# EAGLE design IOTBee-Carrier v0.1 (EAGLE 6.6.0)
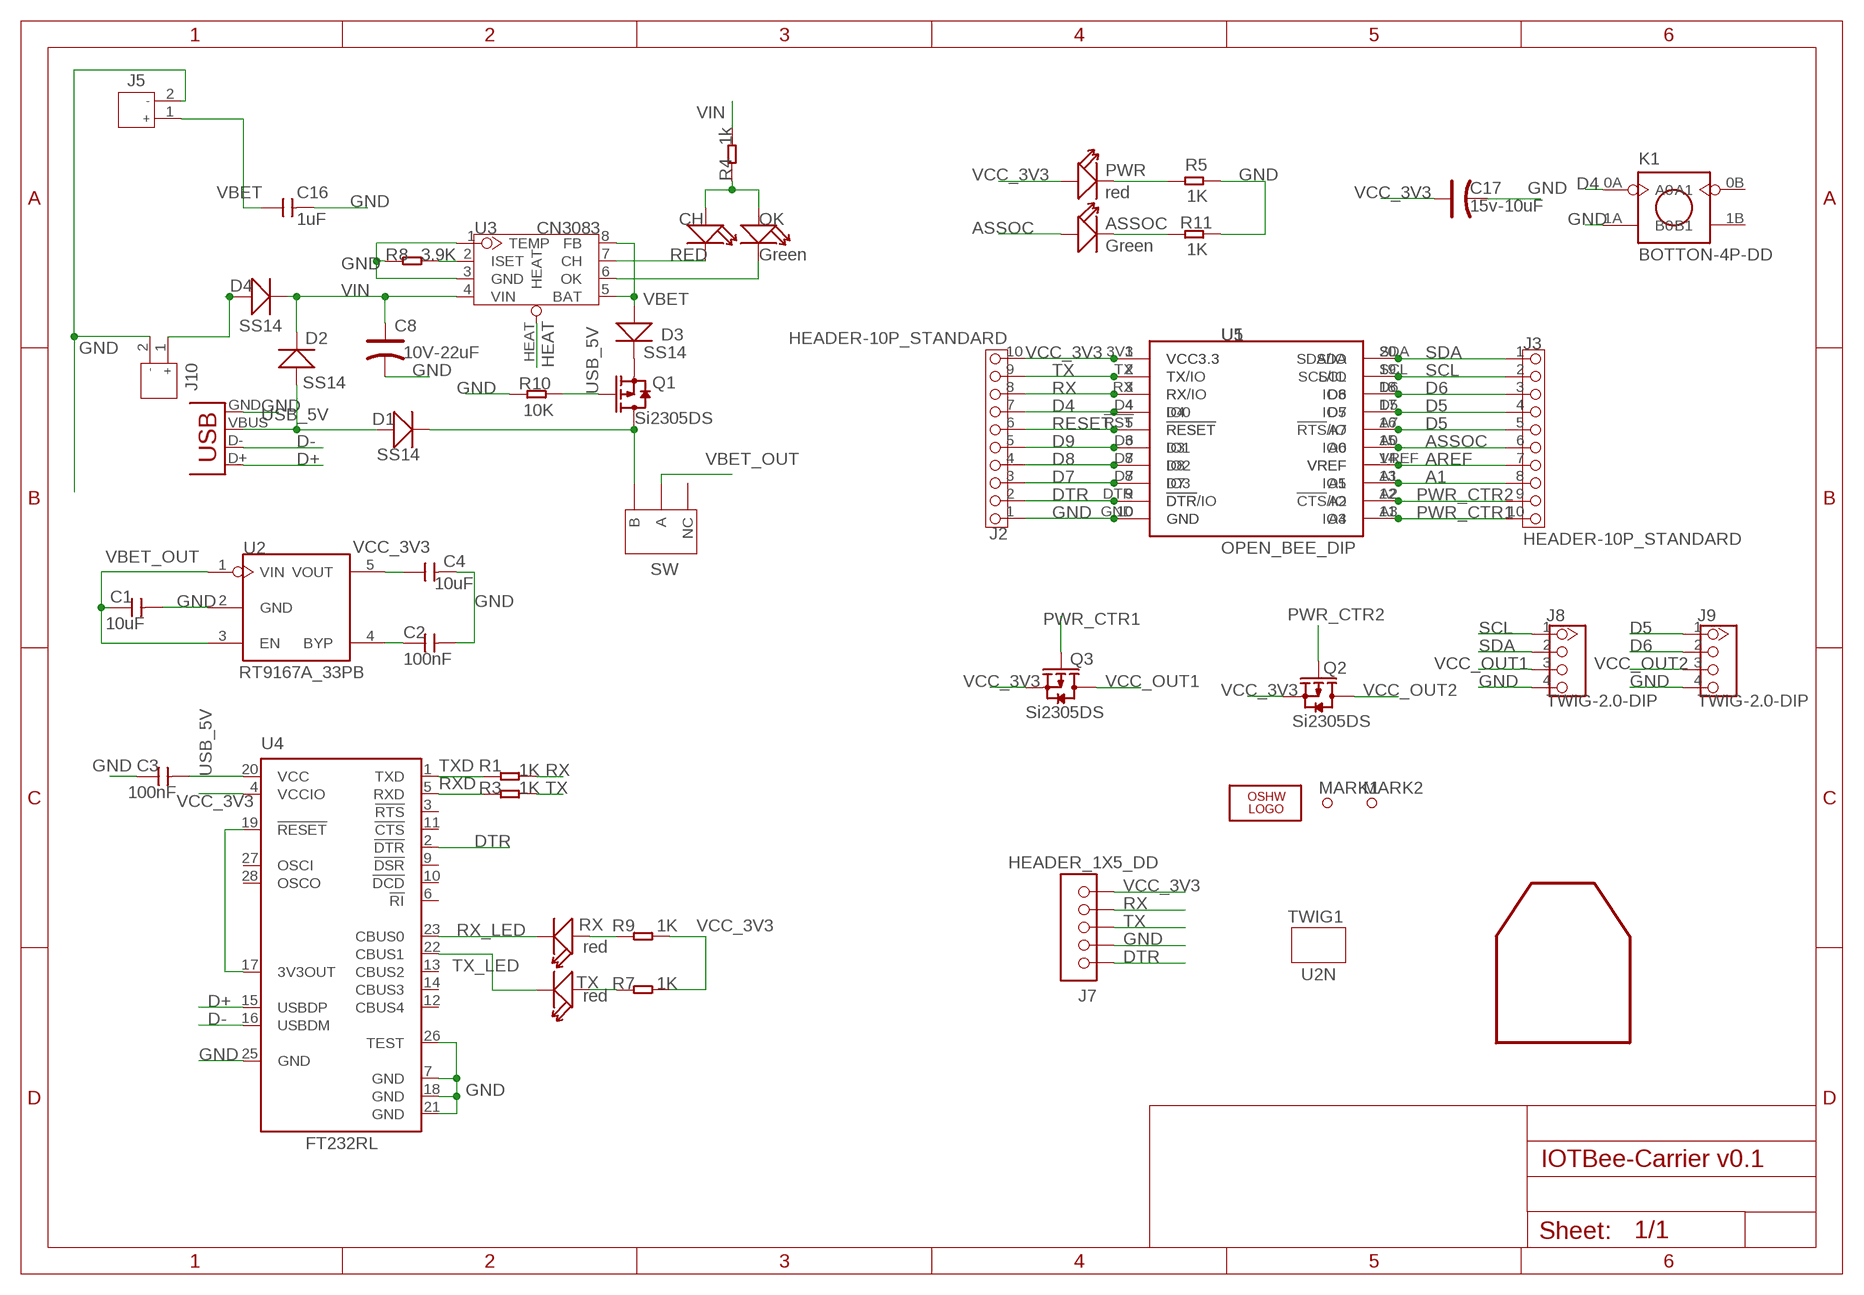
[diagram p0: schematic, sheet 1]

## Parts
ASSOC  Green  LED-0603  [D0603]
C1  10uF  C-0805  [0805]
C2  100nF  C-0603  [0603]
C3  100nF  C-0603  [0603]
C4  10uF  C-0805  [0805]
C8  10V-22uF  CAP_AVX_B  [AVX-B]
C16  1uF  C-0805  [0805]
C17  15v-10uF  CAP_AVX_A  [AVX-A]
CH  RED  LED-0603  [D0603]
D1  SS14  D-2010  [D2010]
D2  SS14  D-2010  [D2010]
D3  SS14  D-2010  [D2010]
D4  SS14  D-2010  [D2010]
J2  HEADER-10P_STANDARD  [2.54_10P]
J3  HEADER-10P_STANDARD  [2.54_10P]
J5  JST-2P-POWER-LEADED  [2P-2.0-LEADED-4.7X6.0]
J7  HEADER_1X5_DD  [CK_1X5]
J8  TWIG-2.0-DIP  [2.0_1X4]
J9  TWIG-2.0-DIP  [2.0_1X4]
J10  JST-2P-POWER-LEADED  [2P-2.0-LEADED-4.7X6.0]
K1  BOTTON-4P-DD  [BTN-S]
LOGO2  OSHW_LOGO_FILLX0200-NT  [OSHW_FILLX200_NOTEXT]
MARK1  PAD-MARK  [MARK]
MARK2  PAD-MARK  [MARK]
OK  Green  LED-0603  [D0603]
PWR  red  LED-0805  [D0805]
Q1  Si2305DS  010-P-MOSFETSOT23  [SOT23]
Q2  Si2305DS  010-P-MOSFETSOT23  [SOT23]
Q3  Si2305DS  010-P-MOSFETSOT23  [SOT23]
R1  1K  R-0603  [0603]
R3  1K  R-0603  [0603]
R4  1k  R-0603  [0603]
R5  1K  R-0603  [0603]
R7  1K  R-0603  [0603]
R8  3.9K  R-0603  [0603]
R9  1K  R-0603  [0603]
R10  10K  R-0603  [0603]
R11  1K  R-0603  [0603]
RX  red  LED-0603  [D0603]
SW  SWITCH-3P  [008-SW-3P-DIP]
TWIG1  U2N  [U2N_SILK]
TX  red  LED-0603  [D0603]
U1  OPEN_BEE_DIP  [CCBEE-PRO]
U2  RT9167A_33PB  RT9167A  [SOT23-5]
U3  CN3083  [SOP8]
U4  FT232RL  [SSOP28]
U5  BEE-IOTBEE-IOTBEE-SOCKET  [IOT_BEE_SMD]
U$1  WIFI_SILK  [WIFI_SILK]
X1  USB-SMD-NS  [USB-MINIB-NOSTOP]

## Nets
A1: J3.8 U1.13(IO5) U5.A1
AREF: J3.7 U1.14(VREF) U5.VREF
ASSOC: ASSOC.+ J3.6 U1.15(IO6) U5.A0
D4: J2.7 K1.0A(A0) U1.4(IO0) U5.D4
D5: J3.4 J3.5 J9.1 U1.16(!RTS!/IO) U1.17(IO7) U5.A7 U5.D5
D6: J3.3 J9.2 U1.18(IO8) U5.D6
D7: J2.3 U1.8(IO3) U5.D7
D8: J2.4 U1.7(IO2) U5.D8
D9: J2.5 U1.6(IO1) U5.D3
D+: U4.15(USBDP) X1.D+
D-: U4.16(USBDM) X1.D-
DTR: J2.2 J7.1 U1.9(!DTR!/IO) U4.2(!DTR) U5.DTR(!DTR)
GND: C1.2 C2.2 C3.1 C4.2 C8.- C16.2 C17.- J2.1 J5.2 J7.2 J8.4 J9.4 J10.2 K1.1A(B0) R5.1 R8.1 R10.1 R11.1 U1.10(GND) U2.2(GND) U3.1(TEMP) U3.3(GND) U4.7(GND) U4.18(GND) U4.21(GND) U4.25(GND) U4.26(TEST) U5.GND X1.GND
HEAT: U3.HEAT
N$1: PWR.- R5.2
N$2: R8.2 U3.2(ISET)
N$3: D4.+ J10.1
N$6: C2.1 U2.4(BYP)
N$7: CH.- U3.7(CH)
N$8: OK.- U3.6(OK)
N$9: CH.+ OK.+ R4.1
N$10: U4.17(3V3OUT) U4.19(!RESET)
N$11: D3.- Q1.2(S)
N$12: ASSOC.- R11.2
N$13: D1.- Q1.3(D) SW.P$3(B)
N$15: R9.1 RX.+
N$16: R7.1 TX.+
PWR_CTR1: J3.10 Q3.1(G) U1.11(IO4) U5.A3
PWR_CTR2: J3.9 Q2.1(G) U1.12(!CTS!/IO) U5.A2
RESET: J2.6 U1.5(!RESET) U5.!RST(!RESET)
RX: J2.8 J7.4 R1.2 U1.3(RX/IO) U5.RX
RX_LED: RX.- U4.23(CBUS0)
RXD: R3.1 U4.5(RXD)
SCL: J3.2 J8.1 U1.19(SCL/IO) U5.SCL
SDA: J3.1 J8.2 U1.20(SDA/IO) U5.SDA
TX: J2.9 J7.3 R3.2 U1.2(TX/IO) U5.TX
TX_LED: TX.- U4.22(CBUS1)
TXD: R1.1 U4.1(TXD)
USB_5V: C3.2 D1.+ D2.+ Q1.1(G) R10.2 U4.20(VCC) X1.VBUS
VBET: C16.1 D3.+ J5.1 U3.5(BAT) U3.8(FB)
VBET_OUT: C1.1 SW.P$2(A) U2.1(VIN) U2.3(EN)
VCC_3V3: C4.1 C17.+ J2.10 J7.5 PWR.+ Q2.2(S) Q3.2(S) R7.2 R9.2 U1.1(VCC3.3) U2.5(VOUT) U4.4(VCCIO) U5.3V3(VCC3.3)
VCC_OUT1: J8.3 Q3.3(D)
VCC_OUT2: J9.3 Q2.3(D)
VIN: C8.+ D2.- D4.- R4.2 U3.4(VIN)
Unconnected: K1.0B(A1) K1.1B(B1) SW.P$1(NC) U4.3(!RTS) U4.6(!RI) U4.9(!DSR) U4.10(!DCD) U4.11(!CTS) U4.12(CBUS4) U4.13(CBUS2) U4.14(CBUS3) U4.27(OSCI) U4.28(OSCO)

## Library data of the parts
ASSOC CH OK PWR RX TX = Discrete:LED*
C1-C4 C16 = Discrete:C*: Ceramic Capacitors
C8 C17 = Discrete:CAP*: Electrolytic Capacitors,Tantalum Capacitors and Super Capacitors
D1-D4 = Discrete:D*
J2 J3 = Connector:HEADER-10P
J5 J10 = Connector:JST-2P-POWER-LEADED
J7 = CONNECTER:HEADER_1X5
J8 J9 = Connector:TWIG-2.0-DIP
K1 = Discrete:BOTTON-4P
LOGO2 = logo:OSHW_LOGO_FILL
MARK1 MARK2 = Discrete:PAD-MARK
Q1-Q3 = Discrete:010-P-MOSFET*: Si2305DS Si2323CDS
R1 R3-R5 R7-R11 = Discrete:R*
SW = Discrete:SWITCH-3P
TWIG1 = twig_template1:U2N
U1 = EXT_moudle:OPEN_BEE
U2 = IC:RT9167A: Voltage regulator
U3 = IC:CN3083
U4 = IC:FT232R: Source: http://www.ftdichip.com/Documents/DataSheets/DS_FT232R_v104.pdf
U5 = Duinopeak-Module:BEE-IOTBEE
U$1 = seeedleo:WIFI_SILK
X1 = SparkFun-Connectors:USB: USB Connectors USB-B-PTH is fully proven SKU : PRT-00139 USB-miniB is fully proven SKU : PRT-00587 USB-A-PCB is untested. USB-A-H is throughly reviewed, but untested. Spark Fun Electronics SKU : PRT-00437 USB-B-SMT is throughly reviewed, but untested. Needs silkscreen touching up. USB-A-S has not been used/tested USB-MB-H has not been used/tested

## Net classes
0 default: width 0.203 mm, drill 0.305 mm, clearance 0.127 mm

## Board
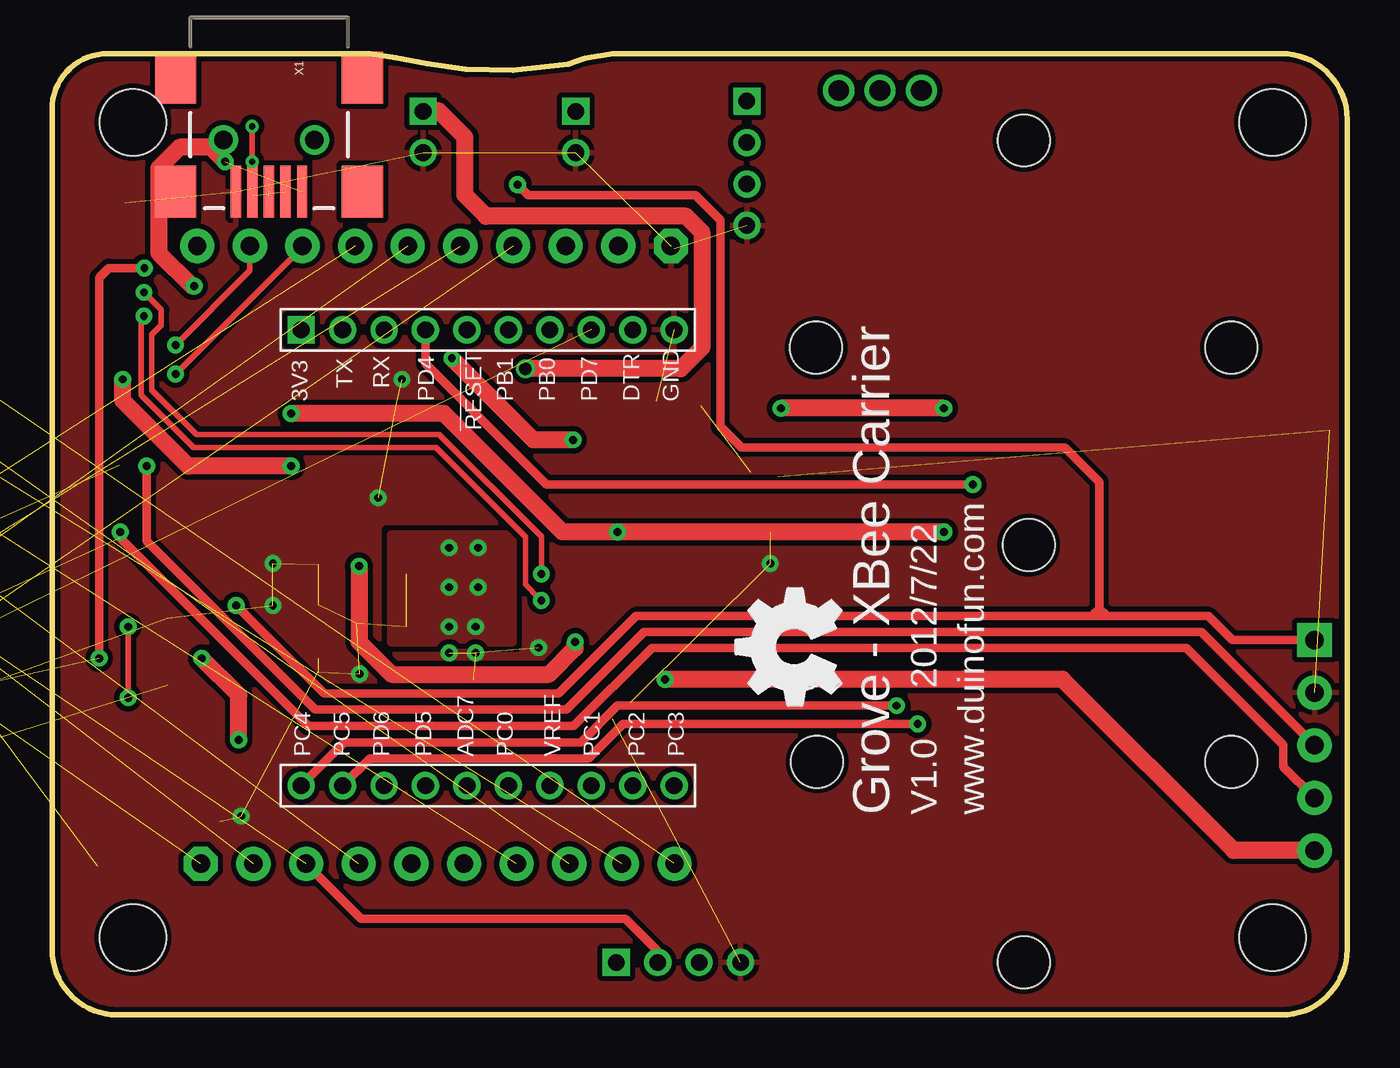
[diagram p1: board, top side]
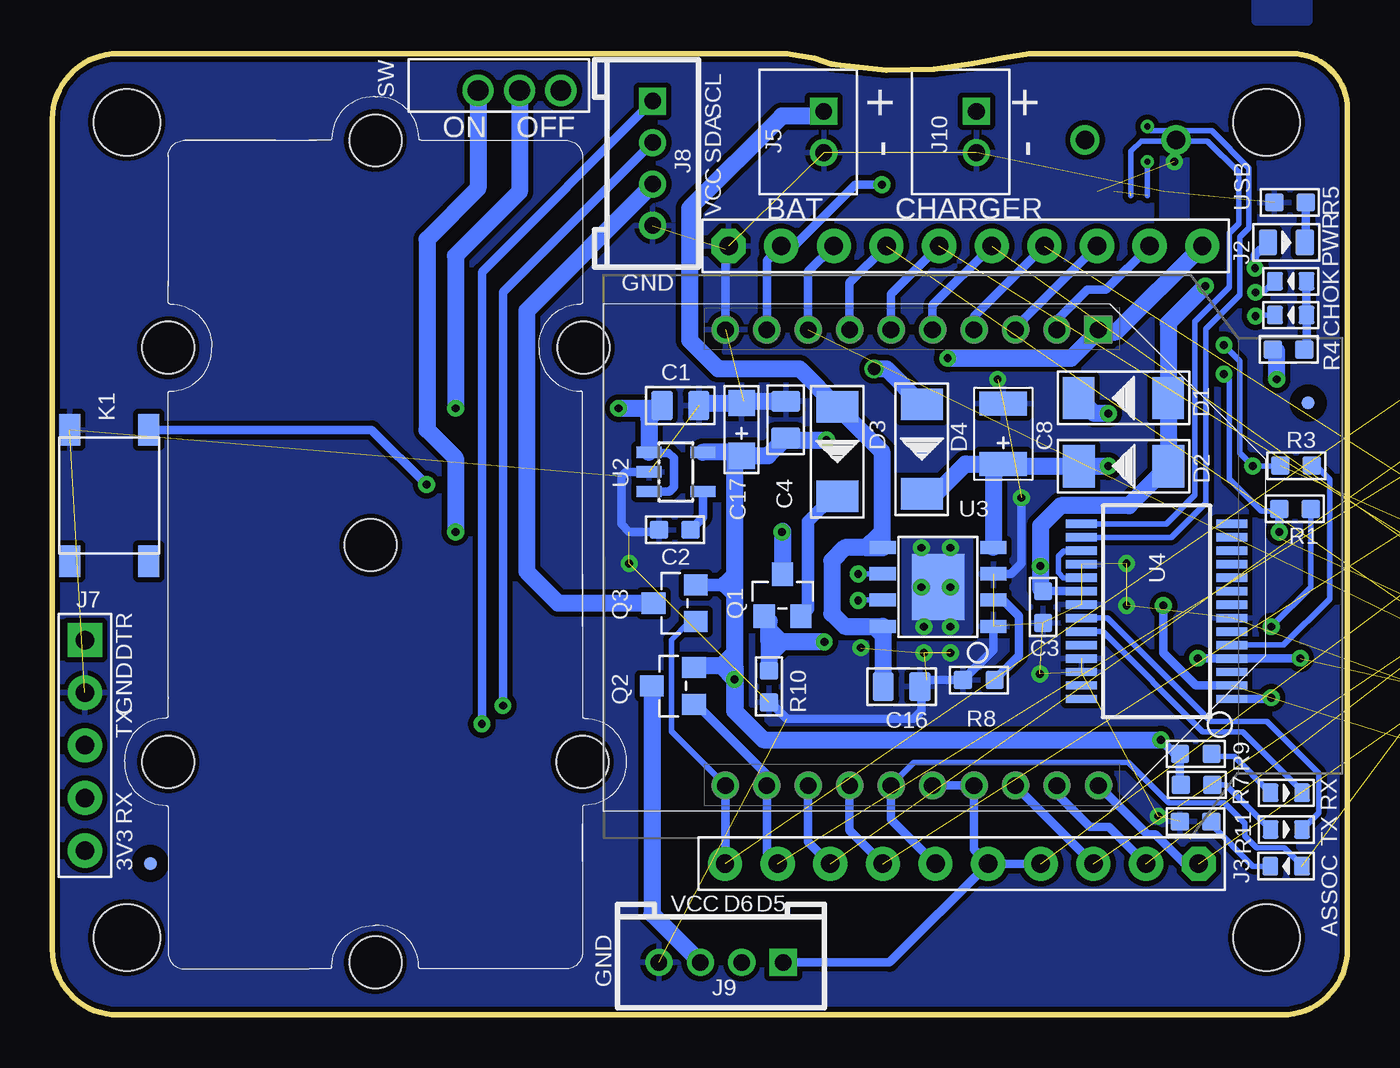
[diagram p2: board, bottom side, seen from below]

Size 62.53 x 46.48 mm. Coordinates in mm from the lower left corner, seen from the top.
Outline: 3.07,0 arc-67 0,2.69
Outline: 59.46,46.48 arc-67 62.54,43.79
Outline: 62.54,3.1 arc-67 59.84,0.02
Outline: 15.37,46.46 15.6,46.38
Outline: 24.49,46 27.08,46.46 59.33,46.46 arc-90 62.51,43.28 62.51,3.23 arc-90 59.33,0.06 3.18,0.06 arc-90 0.01,3.23 0.01,43.75 arc-90 2.72,46.46 15.37,46.46
Outline: 27.05,46.46 25.73,46.23 24.92,45.95 22.25,45.64 19.96,45.7 18.14,45.97 16.59,46.25 15.37,46.46
Copper layers (1*16): Top 0.035mm / dielectric 1.5mm / Bottom 0.035mm
Design rules "default": minimum track width 6mil, minimum drill 12mil, track to track 6mil, track to pad 6mil, pad to pad 6mil, via to via 6mil, smd to smd 0mil, copper to edge 10mil, drill to drill 10mil, minimum pad ring 10mil, minimum via ring 6mil, stop-mask expansion 2mil, vias tented up to drill 0mil, thermal gap 10mil
Holes 3.2 mm at 3.92,3.79 58.91,3.79 58.91,43.14 3.92,43.14
Holes 2.5 mm at 46.91,2.59 36.88,32.26 36.93,12.27 47.14,22.73 56.92,32.26 46.91,42.27 56.92,12.27

### Footprints (pad centres in the part's own frame; a part is rotated, then mirrored left to right if it is on the bottom)
D0603 = smd 0.762 x 0.889: + -0.762,0; - 0.762,0
0805 = smd 1.016 x 1.397: 1 -0.889,0; 2 0.889,0
0603 = smd 0.889 x 0.889: 1 -0.762,0; 2 0.762,0
AVX-B = smd 1.143 x 2.286: + -1.46,0; - 1.46,0
AVX-A = smd 1.27 x 1.27: + -1.27,0; - 1.27,0
D2010 = smd 1.524 x 2.032: + -2.159,0; - 2.159,0
2.54_10P = drill 0.889 pad 1.651 octagon: 1 0,11.43 | drill 0.889 pad 1.651: 2 0,8.89; 3 0,6.35; 4 0,3.81; 5 0,1.27; 6 0,-1.27; 7 0,-3.81; 8 0,-6.35; 9 0,-8.89; 10 0,-11.43
2P-2.0-LEADED-4.7X6.0 = drill 0.8 pad 1.3 square: 1 -1,0.75 | drill 0.8 pad 1.3: 2 1,0.75
CK_1X5 = drill 0.889 pad 1.651 square: 1 0,5.08 | drill 0.889 pad 1.651: 2 0,2.54; 3 0,0; 4 0,-2.54; 5 0,-5.08
2.0_1X4 = drill 0.8 pad 1.27 square: 1 -3,0 | drill 0.8 pad 1.27: 2 -1,0; 3 1,0; 4 3,0
BTN-S = smd 1.524 x 1.016: 0A -3.175,1.905; 0B 3.175,1.905; 1A -3.175,-1.905; 1B 3.175,-1.905
MARK = smd 0.635 x 0.635: P$1 0,0
D0805 = smd 0.889 x 1.27: + -0.889,0; - 0.889,0
SOT23 = smd 1.016 x 1.143: 1 -0.889,-1.016; 2 0.889,-1.016; 3 0,1.016
008-SW-3P-DIP = drill 1 pad 1.5: P$1 -3,0.24; P$2 -1,0.24; P$3 1,0.24
CCBEE-PRO = drill 0.813 square: 1 -11,9 | drill 0.813: 2 -11,7; 3 -11,5; 4 -11,3; 5 -11,1; 6 -11,-1; 7 -11,-3; 8 -11,-5; 9 -11,-7; 10 -11,-9; 11 11,-9; 12 11,-7; 13 11,-5; 14 11,-3; 15 11,-1; 16 11,1; 17 11,3; 18 11,5; 19 11,7; 20 11,9
SOT23-5 = smd 0.55 x 1.2: 1 -0.95,-1.3; 2 0,-1.3; 3 0.95,-1.3; 4 0.95,1.3; 5 -0.95,1.3
SOP8 = smd 0.635 x 1.27: 1 -1.905,-2.667; 2 -0.635,-2.667; 3 0.635,-2.667; 4 1.905,-2.667; 5 1.905,2.667; 6 0.635,2.667; 7 -0.635,2.667; 8 -1.905,2.667 | smd 3.175 x 2.54: HEAT 0,0
SSOP28 = smd 0.4 x 1.5: 1 -4.225,-3.625; 2 -3.575,-3.625; 3 -2.925,-3.625; 4 -2.275,-3.625; 5 -1.625,-3.625; 6 -0.975,-3.625; 7 -0.325,-3.625; 8 0.325,-3.625; 9 0.975,-3.625; 10 1.625,-3.625; 11 2.275,-3.625; 12 2.925,-3.625; 13 3.575,-3.625; 14 4.225,-3.625; 15 4.225,3.625; 16 3.575,3.625; 17 2.925,3.625; 18 2.275,3.625; 19 1.625,3.625; 20 0.975,3.625; 21 0.325,3.625; 22 -0.325,3.625; 23 -0.975,3.625; 24 -1.625,3.625; 25 -2.275,3.625; 26 -2.925,3.625; 27 -3.575,3.625; 28 -4.225,3.625
IOT_BEE_SMD = smd 1.7 x 0.85: 3V3 -12.182,7.554; !RST -12.182,-0.446; A0 12.818,-2.446; A1 12.818,-6.446; A2 9.818,-8.446; A3 12.818,-10.446; A7 9.818,-0.446; D3 -9.182,-2.446; D4 -9.182,1.554; D5 12.818,1.554; D6 9.818,3.554; D7 -9.182,-6.446; D8 -12.182,-4.446; DTR -12.182,-8.446; GND -9.182,-10.446; RX -12.182,3.554; SCL 12.818,5.554; SDA 9.818,7.554; TX -9.182,5.554; VREF 9.818,-4.446
USB-MINIB-NOSTOP = smd 2.5 x 0.5: D+ 2.5,0; D- 2.5,0.8; GND 2.5,-1.6; ID 2.5,-0.8; VBUS 2.5,1.6 | smd 2.5 x 2: G1 -3,-4.5; G2 -3,4.5; G3 2.5,4.5; G4 2.5,-4.5 | drill 0.9 pad 0.8: H1 0,2.2 | drill 0.9 pad 0.787: H2 0,-2.2

### Placement (x,y rotation side)
ASSOC  2.97,7.24 180 bottom
C1  32.2,29.47 0 bottom
C2  32.47,23.47 180 bottom
C3  14.7,19.75 90 bottom
C4  27.12,28.79 90 bottom
C8  16.62,28.11 90 bottom
C16  21.53,15.9 0 bottom
C17  29.25,28.32 90 bottom
CH  2.75,33.84 180 bottom
D1  10.82,29.83 180 bottom
D2  10.82,26.54 180 bottom
D3  24.63,27.24 270 bottom
D4  20.55,27.37 270 bottom
J2  18.45,37.17 90 bottom
J3  18.62,7.36 270 bottom
J5  26.04,42.67 270 bottom
J7  60.94,13.07 0 bottom
J8  33.54,41.16 270 bottom
J9  30.24,2.6 180 bottom
J10  18.67,42.67 270 bottom
K1  59.76,25.12 270 bottom
LOGO2  38.1,14.99 90 top
MARK1  57.79,7.37 270 bottom
MARK2  1.91,29.59 270 bottom
OK  2.75,35.47 180 bottom
PWR  2.96,37.34 0 bottom
Q1  27.27,20.32 0 bottom
Q2  32.56,15.93 90 bottom
Q3  32.48,19.93 90 bottom
R1  2.55,24.48 180 bottom
R3  2.49,26.57 180 bottom
R4  2.85,32.18 180 bottom
R5  2.79,39.27 0 bottom
R7  7.29,11.16 180 bottom
R8  17.8,16.22 0 bottom
R9  7.33,12.66 180 bottom
R10  27.92,15.91 90 bottom
R11  7.34,9.39 0 bottom
RX  2.97,10.78 0 bottom
SW  40.97,44.92 180 bottom
TWIG1  47.14,22.1 270 bottom
TX  2.96,9.01 0 bottom
U1  21.03,22.13 270 bottom
U2  32.42,26.27 270 bottom
U3  19.77,20.71 90 bottom
U4  9.22,19.53 90 bottom
U5  -21.08,22.48 90 top  (outside the outline)
U$1  21.36,22 270 bottom
X1  10.48,42.29 270 top

### Tracks (layer width: path | path; a pad name or v marks a point on that pad's centre or on a via)
A1  (1 unrouted)
  Bottom 0.406: U1.13 26.03,8.42 J3.8
AREF  (1 unrouted)
  Bottom 0.406: U1.14 24.03,8.96 J3.7
ASSOC  (1 unrouted)
  Bottom 0.254: ASSOC.+ 2.21,7.29 3.05,8.13 4.39,8.13 4.95,8.7 4.95,9.29 5.95,10.29 8.64,10.29 10.59,12.24 20.92,12.24 U1.15
  Bottom 0.406: U1.15 22.03,9.5 J3.6
D4  (via drill 0.38 pad 0.81)  (1 unrouted)
  Top 0.406: v44.45,25.65 23.88,25.65 18.03,31.5 U1.4
  Bottom 0.406: U1.4 18.03,33.77 J2.7 | K1.0A 47.09,28.3 v44.45,25.65
D5  (2 unrouted)
  Bottom 0.406: J9.1 22.11,2.6 J3.5 | U1.16 U1.17 18.03,8.04 J3.5 | J3.5 J3.4
D6  (1 unrouted)
  Top 0.406: J9.2 29.24,3.15 27.69,4.7 14.93,4.7 J3.3
  Bottom 0.406: U1.18 J3.3
D7  (1 unrouted)
  Bottom 0.406: U1.8 26.03,35.93 J2.3
D8  (1 unrouted)
  Bottom 0.406: U1.7 24.03,35.39 J2.4
D9  (1 unrouted)
  Bottom 0.406: U1.6 22.03,34.85 J2.5
D+  (1 unrouted)
  Bottom 0.254: U4.15 8.75,23.76 7.37,25.15 7.37,33.53 5.72,35.18 5.72,37.79 5.27,38.24 5.27,40.74 6.77,42.24 9.97,42.24 10.47,41.74 10.47,39.59
D-  (via drill 0.3 pad 0.64)  (1 unrouted)
  Top 0.254: v9.67,42.94 v9.67,41.24
  Bottom 0.254: U4.16 8.52,23.11 6.86,24.76 6.86,33.15 5.21,34.8 5.21,37.59 4.77,38.04 4.77,40.94 6.57,42.74 9.47,42.74 v9.67,42.94 | v9.67,41.24 9.67,39.6
DTR  (via drill 0.38 pad 0.81)  (1 unrouted)
  Top 0.406: 50.93,19.3 50.55,19.3 | 50.55,19.3 50.17,19.3 | 50.17,19.3 28.19,19.3 24.46,15.57 13.13,15.57 v8.89,19.81 | 50.55,19.3 50.55,19.68 | 50.55,19.68 50.55,25.78 48.9,27.43 33.27,27.43 32.26,28.45 32.26,38.43 31.06,39.62 22.99,39.62 v22.48,40.13 | 50.55,19.68 50.17,19.3 | 50.93,19.3 50.55,19.68 | 50.93,19.3 55.8,19.3 56.96,18.15 J7.1
  Bottom 0.406: U1.9 28.03,36.47 J2.2 26.71,37.17 23.75,40.13 v22.48,40.13 | v8.89,19.81 8.89,17.53 7.32,15.96 U4.2
GND  (via drill 0.38 pad 0.81)  (30 unrouted)
  Bottom 0.406: U1.10 30.03,37.01 J2.1 | U2.2 34.82,26.27 35.05,26.04 35.05,23.75 34.67,23.37 33.34,23.37 C2.2 | R10.1 27.85,15.15 27.05,14.35 20.96,14.35 20.57,14.73 20.57,15.84 C16.2 20.33,16.22 R8.1 17.1,17.68 U3.1 | U3.3 16.24,21.35 15.75,21.84 v15.75,25.02
  Bottom 0.813: C4.2 29.16,29.68 C17.- 31.19,29.59 C1.2
  other vias: 16.89,30.73 14.86,16.51 10.67,19.81 23.49,17.78 34.67,21.84 10.67,21.84 20.45,17.53 19.18,17.53 9.14,9.65
  pour Bottom: 1.91,49.91 1.91,48.01 4.45,48.01 4.45,49.91
  pour Bottom (isolate 0.254, rank 2): -0.13,46.74 -0.13,-0.13 62.99,-0.13 62.99,46.74
  pour Top (isolate 0.254, rank 2): -0.13,46.74 -0.13,-0.13 62.99,-0.13 62.99,46.74
HEAT  (via drill 0.38 pad 0.81)
  other vias: 19.18,22.61 20.57,22.61 19.18,20.7 19.18,18.8 20.45,18.8 20.57,20.7
  pour Bottom (isolate 0.254, no thermals): 18.29,22.99 18.29,18.54 21.34,18.54 21.34,22.99
  pour Top (isolate 0.254): 16.38,23.24 16.38,18.03 22.22,18.03 22.22,23.24
N$1
  Bottom 0.406: R5.2 2.03,37.39 PWR.-
N$2
  Bottom 0.406: U3.2 16.65,20.08 15.88,19.3 15.88,17.38 R8.2
N$3  (via drill 0.6)
  Top 0.813: v22.86,31.24 30.35,31.24 31.37,32.26 31.37,37.85 30.61,38.61 20.96,38.61 19.94,39.62 19.94,42.42 18.67,43.69 17.94,43.69 J10.1
  Bottom 0.813: v22.86,31.24 22.27,31.24 D4.+
N$6
  Bottom 0.406: U2.4 31.12,24.06 C2.1
N$7  (via drill 0.38 pad 0.81)
  Top 0.254: v23.62,20.07 23.5,20.07 23.5,20.19 22.86,20.83 22.86,23.11 18.54,27.43 6.86,27.43 4.32,29.97 4.32,33.66 v4.45,33.78
  Bottom 0.254: U3.7 23.61,20.08 v23.62,20.07 | CH.- 4.39,33.84 v4.45,33.78
N$8  (via drill 0.38 pad 0.81)
  Top 0.254: v23.62,21.34 23.62,23.14 18.7,28.07 6.99,28.07 4.83,30.23 4.83,32.89 5.28,33.35 5.28,34.09 v4.45,34.93
  Bottom 0.254: U3.6 23.61,21.35 v23.62,21.34 | OK.- 3.53,35.47 4.07,34.94 v4.44,34.94 v4.45,34.93
N$9
  Bottom 0.406: OK.+ CH.+ 1.99,32.28 R4.1
N$10
  Bottom 0.254: U4.19 13.71,21.16 13.97,21.42 13.97,22.19 13.71,22.46 U4.17
N$11
  Bottom 0.61: D3.- 24.83,25.09 26.04,23.88 26.04,19.64 Q1.2
N$12
  Bottom 0.254: R11.2 6.58,9.25 4.57,7.24 ASSOC.-
N$13  (via drill 0.38 pad 0.81)
  Top 0.813: v43.05,23.37 v27.31,23.37 24.64,23.37 18.92,29.08 v11.56,29.08
  Bottom 0.813: Q1.3 27.27,23.41 v27.31,23.37 | 12.97,29.84 D1.- 12.23,29.08 v11.56,29.08 | SW.P$3 41.97,39.95 44.43,37.49 44.43,28.3 43.05,26.92 v43.05,23.37
N$15
  Bottom 0.254: RX.+ 5.48,12.53 6.44,12.53 R9.1
N$16
  Bottom 0.254: R7.1 5.88,11.16 TX.+
PWR_CTR1  (1 unrouted)
  Bottom 0.254: Q3.1 31.76,19.04 32.64,18.16 32.64,13.73 U1.11
  Bottom 0.406: U1.11 30.03,7.37 J3.10
PWR_CTR2  (1 unrouted)
  Bottom 0.406: J3.9 28.03,7.88 U1.12 28.07,11.16 28.07,11.68 31.42,15.04 Q2.1
RESET  (1 unrouted)
  Bottom 0.406: U1.5 20.03,34.31 J2.6
RX  (via drill 0.38 pad 0.81)  (1 unrouted)
  Top 0.254: J2.8 12.1,37.11 v5.97,30.99
  Top 0.406: v3.3,23.37 3.3,23.07 12.38,14 25.17,14 28.96,17.78 54.74,17.78 59.44,13.08 59.44,12.04 J7.4
  Bottom 0.254: v5.97,30.99 5.72,30.73 5.72,25.92 4.18,24.38 3.41,24.38 R1.2
  Bottom 0.406: U1.3 16.03,33.23 J2.8 | v3.3,23.37 R1.2
RX_LED
  Bottom 0.254: RX.- 2.16,10.82 5.05,13.72 6.99,13.72 11.83,18.56 U4.23
RXD
  Bottom 0.254: R3.1 1.55,26.57 0.88,25.89 0.88,20.14 3.11,17.91 U4.5
SCL  (via drill 0.38 pad 0.81)  (1 unrouted)
  Top 0.406: v41.78,14.1 27.56,14.1 25.91,12.45 15.35,12.45 U1.19
  Bottom 0.406: U1.19 14.03,10.73 12.45,9.14 11.52,9.14 J3.2 | J8.1 41.78,35.92 v41.78,14.1
SDA  (via drill 0.38 pad 0.81)  (1 unrouted)
  Top 0.406: v40.77,14.99 27.31,14.99 25.53,13.21 14.12,13.21 U1.20
  Bottom 0.406: J8.2 40.77,34.93 v40.77,14.99 | J3.1 7.86,7.36 9.27,8.76 9.67,8.76 U1.20
TX  (via drill 0.38 pad 0.81)  (1 unrouted)
  Top 0.254: J2.9 9.56,35.97 v5.97,32.38
  Top 0.406: v4.57,26.54 4.57,22.93 12.7,14.8 24.83,14.8 28.58,18.54 55.47,18.54 J7.3
  Bottom 0.254: v5.97,32.38 5.21,31.62 5.21,27.18 v4.57,26.54 3.27,26.54 R3.2
  Bottom 0.406: U1.2 14.03,33.59 12.57,35.05 11.67,35.05 J2.9
TX_LED
  Bottom 0.254: TX.- 1.4,9.81 1.4,11.71 3.91,14.22 6.6,14.22 11.59,19.21 U4.22
TXD  (via drill 0.38 pad 0.81)
  Top 0.254: v3.68,18.8 v3.68,15.37
  Bottom 0.254: R1.1 1.78,20.7 v3.68,18.8
  Bottom 0.406: U4.1 3.74,15.31 v3.68,15.37
USB_5V  (via drill 0.38 pad 0.81)  (1 unrouted)
  Top 0.813: v25.26,18.06 25.26,17.77 23.99,16.5 16.4,16.5 14.83,18.07 v14.83,21.72 | v6.87,35.24 6.77,35.24 5.17,36.84 5.17,40.94 6.17,41.94 7.67,41.94 v8.37,41.24
  Bottom 0.406: U4.20 C3.2
  Bottom 0.813: 27.93,18.03 27.93,19.07 Q1.1 | 27.93,18.03 R10.2 | 27.93,18.03 27.9,18.06 27.33,18.06 | v25.26,18.06 27.33,18.06 | 27.33,18.06 27.81,18.54 27.81,17.53 27.43,17.91 | C3.2 14.83,20.63 v14.83,21.72 14.83,23.66 13.84,24.64 10.56,24.64 D2.+ D1.+ 8.66,33.44 v6.87,35.24
  pour Bottom (isolate 0.254, no thermals): 8.96,41.74 8.96,38.54 7.77,38.54 7.77,41.74
VBET
  Bottom 0.813: 23.24,22.61 22.45,22.61 U3.5 22.48,22.66 22.48,23.24 | 23.24,22.61 24.26,22.61 24.89,21.97 24.89,19.43 24.27,18.81 U3.8 22.44,18.37 | D3.+ 24.38,29.65 | D3.+ 26.47,31.24 30.38,31.24 31.75,32.62 31.75,38.99 27.31,43.43 25.52,43.43 J5.1 | D3.+ 22.48,27.26 22.48,23.24 | C16.1 22.44,15.92 22.44,18.37 | 22.48,23.24 22.61,23.24 23.24,22.61 | 22.44,18.37 22.86,18.8
VBET_OUT  (via drill 0.38 pad 0.81)
  Top 0.813: v43.05,29.34 v35.18,29.34
  Bottom 0.406: U2.3 32.72,25.32 32.51,25.53 32.51,26.92 32.77,27.18 33.68,27.18 U2.1
  Bottom 0.813: U2.1 33.72,28.84 C1.1 33.22,29.34 34.04,29.34 | SW.P$2 39.97,39.79 43.05,36.7 v43.05,29.34 | v35.18,29.34 34.04,29.34 | 34.04,29.34 33.66,28.96
VCC_3V3  (via drill 0.38 pad 0.81)  (1 unrouted)
  Top 0.406: v4.47,36.11 2.75,36.11 2.29,35.64 v2.29,17.27
  Top 0.813: v19.3,31.75 23.24,27.81 v25.15,27.81 | J7.5 57.03,7.99 48.77,16.26 v29.59,16.26 | v9.02,13.34 9.02,15.49 v7.24,17.27
  Bottom 0.406: v9.02,13.34 8.22,12.53 R9.2 8.09,11.21 | 8.09,11.21 8.13,11.18 | 8.09,11.2 8.09,11.07 | 8.09,11.21 8.09,11.2 | 8.09,11.2 R7.2 | v7.24,17.27 7.22,17.26 U4.4 2.3,17.26 v2.29,17.27 | v4.47,36.11 4.47,36.72 PWR.+
  Bottom 0.61: 30.12,20.82 29.7,20.82 29.57,20.95 | 30.12,20.82 Q3.2 | 30.12,20.82 30.12,20.93 29.72,21.34 | 30.12,20.82 30.12,20.73 29.72,20.32
  Bottom 0.813: 29.57,27.22 U2.5 | 29.57,27.22 29.42,27.22 C17.+ 27.97,27.05 C4.1 27.03,27.81 v25.15,27.81 | 29.57,27.22 29.57,20.95 29.57,16.89 | Q2.2 31.48,16.89 30.23,16.89 | 29.57,14.71 29.59,14.73 v29.59,16.26 30.23,16.89 | v9.02,13.34 28.19,13.34 29.57,14.71 | v19.3,31.75 13.34,31.75 12.03,33.05 U1.1 11.93,33.02 11.18,33.02 J2.10 | 29.57,16.89 29.57,14.71 | 30.23,16.89 29.57,16.89 | 30.23,16.89 29.59,17.53
VCC_OUT1
  Bottom 0.813: J8.3 33.54,40.12 39.62,34.04 39.62,21.46 38.1,19.94 33.51,19.94 Q3.3
VCC_OUT2
  Bottom 0.813: J9.3 33.58,4.94 Q2.3
VIN  (via drill 0.38 pad 0.81)
  Top 0.813: v11.56,26.54 6.58,26.54 3.43,29.7 v3.43,30.73
  Bottom 0.813: D4.- 20.48,25.27 19.81,25.27 18.44,26.65 C8.+ | D2.- v11.56,26.54 | D2.- | D2.- 16.52,26.54 C8.+ | U3.4 17.1,26.17 C8.+ | v3.43,30.73 3.43,32.11 3.5,32.18 R4.2

### Text on the board
tPlace: 3V3 | TX | RX | PD4 | PB1 | PB0 | PD7 | DTR | GND | RESET | 2012/7/22 | PC4 | PC5 | PD6 | PD5 | ADC7 | PC0 | VREF | PC1 | PC2 | PC3 | Grove - XBee Carrier | V1.0 | www.duinofun.com
bPlace: + | + | SCL | OFF | ON | - | - | SDA | USB | CHARGER | BAT | VCC | GND | DTR | GND | TX | RX | 3V3 | D5 | D6 | VCC | GND